# EAGLE design miniFlySong_J010706C (EAGLE 7.7.0)
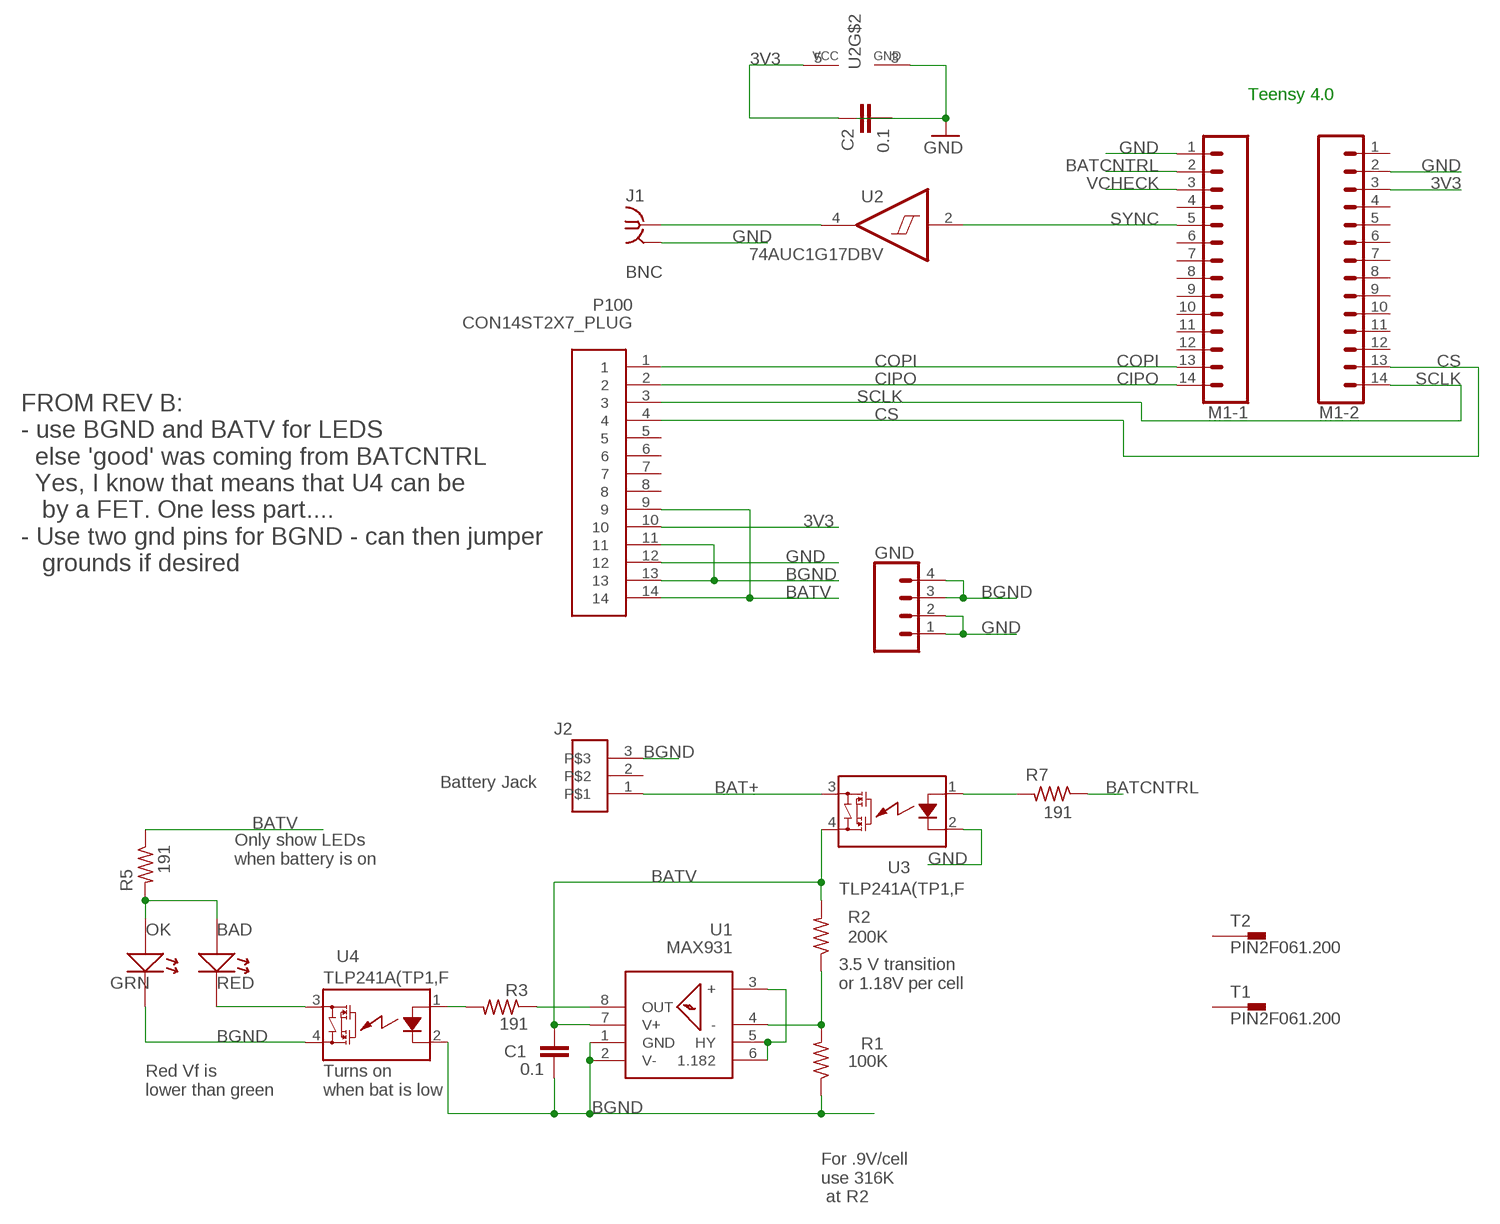
[diagram p0: schematic, sheet 1]

## Parts
BAD  LED4045  [LED_SIDE_SHF4045]
C1  0.1  CAPS0603S  [0603S]
C2  0.1  CAPS0603S  [0603S]
GND  CONN_04LOCK  [1X04_LOCK]
J1  BNC  [BNC-VERT]
J2  Battery Jack  CON3975  [975]
M1-1  CONN_14  [1X14]
M1-2  CONN_14  [1X14]
OK  LED4045  [LED_SIDE_SHF4045]
P100  CON14ST2X7_PLUG  [2X7_PLUG]
R1  100K  RESISTOR_SM0805S  [0805S]
R2  200K  RESISTOR_SM0805S  [0805S]
R3  191  RESISTOR_SM0805S  [0805S]
R5  191  RESISTOR_SM0805S  [0805S]
R7  191  RESISTOR_SM0805S  [0805S]
T1  PIN2F061.200  [F061.200]
T2  PIN2F061.200  [F061.200]
U1  MAX931  [SOIC8]
U2  74AUC1G17DBV  [SOT23-5]
U3  TLP241A(TP1,F  RELAY_SSRSMD4-GULL  [SMD4-GULL]
U4  TLP241A(TP1,F  RELAY_SSRSMD4-GULL  [SMD4-GULL]

## Nets
3V3: C2.1 M1-2.3 P100.10 U2.5(VCC)
BAT+: J2.1 U3.3(DS1)
BATCNTRL: M1-1.2 R7.1
BATV: C1.1 P100.9 P100.14 R2.2 R5.1 U1.7(V+) U3.4(DS2)
BGND: C1.2 GND.3 GND.4 J2.3 OK.C(K) P100.11 P100.13 R1.1 U1.1(GND) U1.2(V-) U4.2(K) U4.4(DS2)
CIPO: M1-1.14 P100.2
COPI: M1-1.13 P100.1
CS: M1-2.13 P100.4
GND: C2.2 GND.1 GND.2 J1.2(GND) M1-1.1 M1-2.2 P100.12 U2.3(GND) U3.2(K)
N$2: J1.1 U2.4(O)
N$3: BAD.A OK.A R5.2
N$4: BAD.C(K) U4.3(DS1)
N$5: R3.2 U4.1(A)
N$7: R7.2 U3.1(A)
N$15: R3.1 U1.8(OUT)
N$18: R1.2 R2.1 U1.4(-)
REF: U1.3(+) U1.5(HY) U1.6(1.182)
SCLK: M1-2.14 P100.3
SYNC: M1-1.5 U2.2(I)
VCHECK: M1-1.3
Unconnected: J2.2 M1-1.4 M1-1.6 M1-1.7 M1-1.8 M1-1.9 M1-1.10 M1-1.11 M1-1.12 M1-2.1 M1-2.4 M1-2.5 M1-2.6 M1-2.7 M1-2.8 M1-2.9 M1-2.10 M1-2.11 M1-2.12 P100.5 P100.6 P100.7 P100.8 T1.1A T1.1B T2.1A T2.1B

## Notes on the sheet
- Teensy 4.0
- FROM REV B:
  - use BGND and BATV for LEDS 
    else 'good' was coming from BATCNTRL
    Yes, I know that means that U4 can be 
     by a FET. One less part....
  - Use two gnd pins for BGND - can then jumper 
     grounds if desired
- Only show LEDs
  when battery is on
- GRN | RED
- 3.5 V transition
  or 1.18V per cell
- Red Vf is 
  lower than green
- Turns on 
  when bat is low
- For .9V/cell
  use 316K
   at R2

## Library data of the parts
BAD OK = STEVES_BU:LED
C1 C2 = STEVES_BU:CAPS
GND = SparkFun-Connectors:CONN_04: Multi connection point. Often used as Generic Header-pin footprint for 0.1 inch spaced/style header connections On any of the 0.1 inch spaced packages, you can populate with these: Break Away Headers - Straight <https://www.sparkfun.com/products/116> (PRT-00116) Break Away Male Headers - Right Angle <https://www.sparkfun.com/products/553> (PRT-00553) Female Headers <https://www.sparkfun.com/products/115> (PRT-00115) Break Away Headers - Machine Pin <https://www.sparkfun.com/products/117> (PRT-00117) Break Away Female Headers - Swiss Machine Pin <https://www.sparkfun.com/products/743> (PRT-00743) For SCREWTERMINALS and SPRING TERMINALS visit here: Screw Terimnals on SparkFun.com <https://www.sparkfun.com/search/results?term=Screw+Terminals> (5mm/3.5mm/2.54mm spacing) This device is also useful as a general connection point to wire up your design to another part of your project. Our various solder wires solder well into these plated through hole pads. Hook-Up Wire - Assortment (Stranded, 22 AWG) <https://www.sparkfun.com/products/11375> (PRT-11375) Hook-Up Wire - Assortment (Solid Core, 22 AWG) <https://www.sparkfun.com/products/11367> (PRT-11367) View the entire wire category on our website here <https://www.sparkfun.com/categories/141> Special notes: Molex polarized connector foot print use with SKU : PRT-08231 with associated crimp pins and housings. 1MM SMD Version SKU: PRT-10208; PROD_ID: CONN-09696
J1 = STEVES_BU:BNC
J2 = STEVES_BU:CON3
M1-1 M1-2 = SparkFun-Connectors:CONN_14: Multi connection point. Often used as Generic Header-pin footprint for 0.1 inch spaced/style header connections On any of the 0.1 inch spaced packages, you can populate with these: Break Away Headers - Straight <https://www.sparkfun.com/products/116> (PRT-00116) Break Away Male Headers - Right Angle <https://www.sparkfun.com/products/553> (PRT-00553) Female Headers <https://www.sparkfun.com/products/115> (PRT-00115) Break Away Headers - Machine Pin <https://www.sparkfun.com/products/117> (PRT-00117) Break Away Female Headers - Swiss Machine Pin <https://www.sparkfun.com/products/743> (PRT-00743) For SCREWTERMINALS and SPRING TERMINALS visit here: Screw Terimnals on SparkFun.com <https://www.sparkfun.com/search/results?term=Screw+Terminals> (5mm/3.5mm/2.54mm spacing) This device is also useful as a general connection point to wire up your design to another part of your project. Our various solder wires solder well into these plated through hole pads. Hook-Up Wire - Assortment (Stranded, 22 AWG) <https://www.sparkfun.com/products/11375> (PRT-11375) Hook-Up Wire - Assortment (Solid Core, 22 AWG) <https://www.sparkfun.com/products/11367> (PRT-11367) View the entire wire category on our website here <https://www.sparkfun.com/categories/141> Special notes: Molex polarized connector foot print use with SKU : PRT-08231 with associated crimp pins and housings. 1MM SMD Version SKU: PRT-10208 NOTES ON THE VARIANTS LOCK and LOCK_LONGPADS... This footprint was designed to help hold the alignment of a through-hole component (i.e. 6-pin header) while soldering it into place. You may notice that each hole has been shifted either up or down by 0.005 of an inch from it's more standard position (which is a perfectly straight line). This slight alteration caused the pins (the squares in the middle) to touch the edges of the holes. Because they are alternating, it causes a "brace" to hold the component in place. 0.005 has proven to be the perfect amount of "off-center" position when using our standard breakaway headers. Although looks a little odd when you look at the bare footprint, once you have a header in there, the alteration is very hard to notice. Also,if you push a header all the way into place, it is covered up entirely on the bottom side.
P100 = STEVES_BU:CON14ST
R1-R3 R5 R7 = STEVES_BU:RESISTOR_SM
T1 T2 = con-faston:PIN2: Flachstecker Typ Tyco/Electronics/AMP TAB, FASTON Printed Circuit Board Tabs Source: http://www.buerklin.com, http://catalog.tycoelectronics.com; OC_FARNELL: unknown; OC_NEWARK: unknown
U1 = STEVES_BU:MAX931
U2 = 74xx-little-us:74*1G17: Single Schmitt-Trigger Buffer
U3 U4 = STEVES_BU:RELAY_SSR

## Board
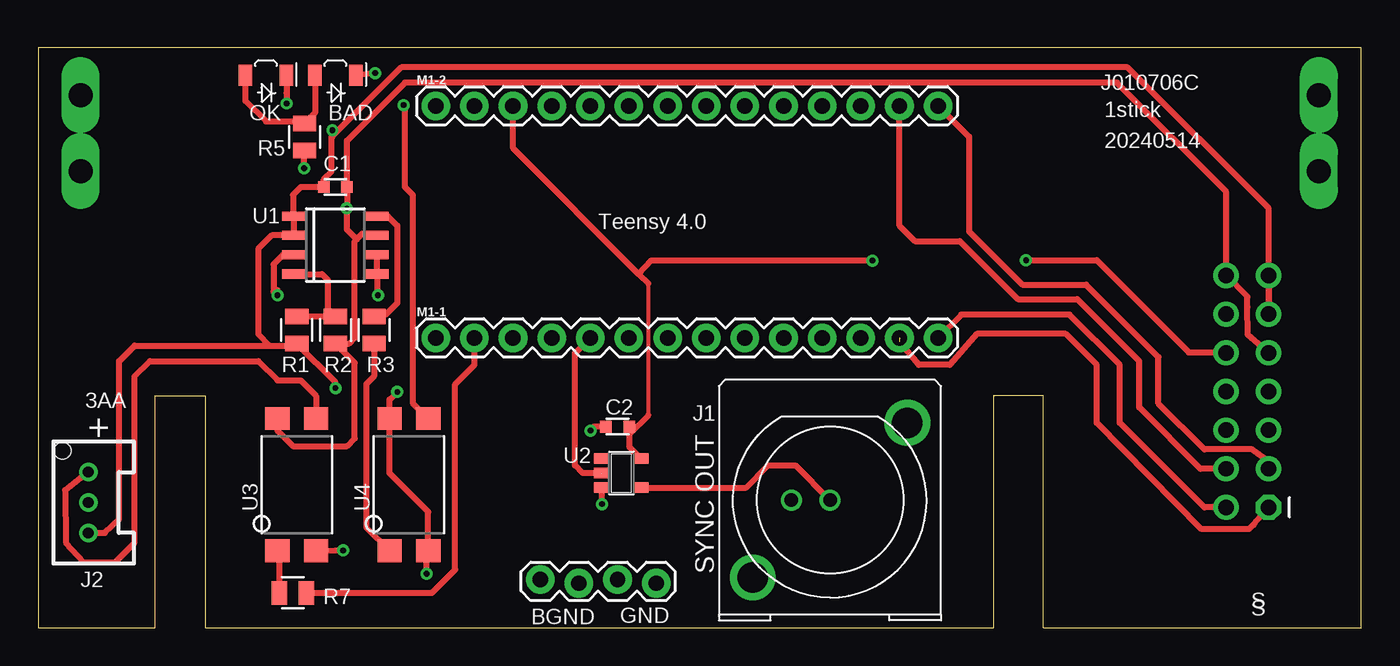
[diagram p1: board, top side]
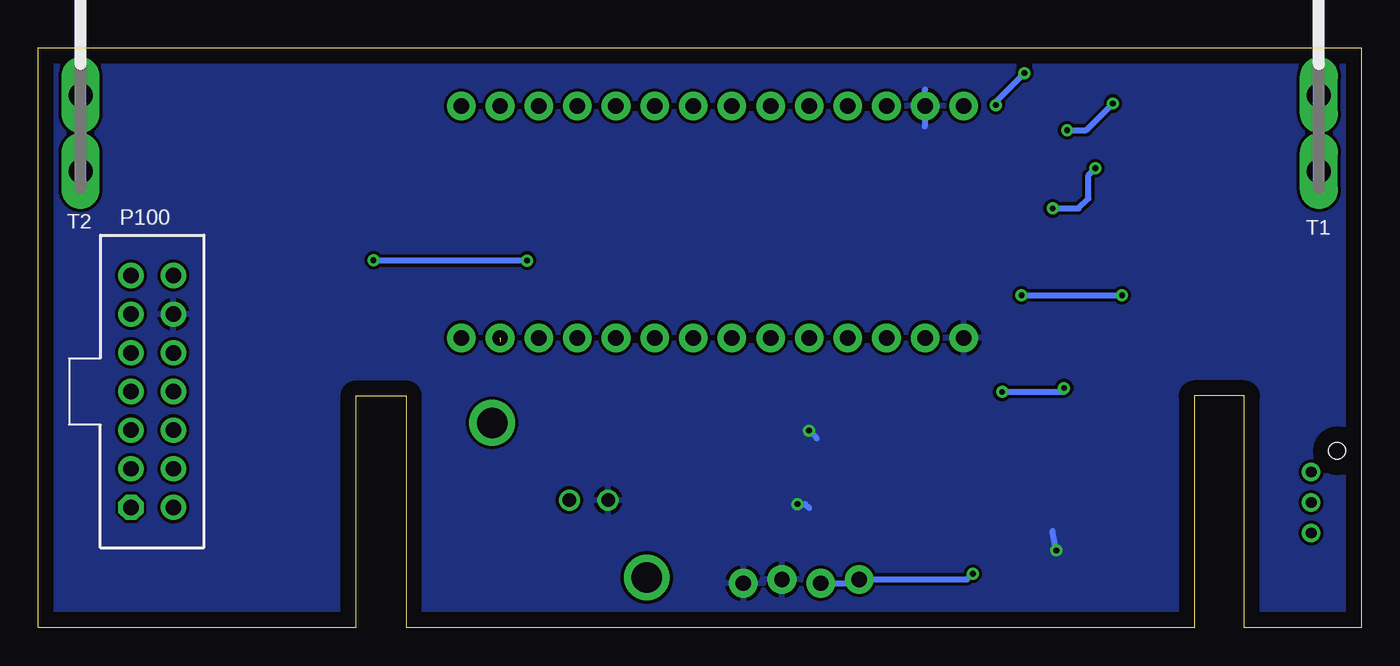
[diagram p2: board, bottom side, seen from below]

Size 87 x 38.1 mm. Coordinates in mm from the lower left corner, seen from the top.
Outline: 0,0 7.7,0 7.7,15.24 11,15.24 11,0 62.8,0 62.8,15.24 66.1,15.24 66.1,0 87,0 87,38.1 0,38.1 0,0
Copper layers (1*16): Top 0.035mm / dielectric 1.5mm / Bottom 0.035mm
Design rules "default *": minimum track width 10mil, minimum drill 12mil, track to track 8mil, track to pad 8mil, pad to pad 8mil, via to via 8mil, smd to smd 8mil, copper to edge 40mil, drill to drill 8mil, minimum pad ring 10mil, minimum via ring 8mil, stop-mask expansion 4mil, vias tented up to drill 0mil, thermal gap 10mil

### Footprints (pad centres in the part's own frame; a part is rotated, then mirrored left to right if it is on the bottom)
LED_SIDE_SHF4045 = smd 0.9 x 1.4: A -1.35,0; C 1.35,0
0603S = smd 0.762 x 0.762: 1 -0.762,0; 2 0.762,0
1X04_LOCK = drill 1.016 pad 1.88: 1 0,0.127; 2 2.54,-0.127; 3 5.08,0.127; 4 7.62,-0.127
BNC-VERT = drill 0.89: 1 0,0; 2 -2.54,0 | drill 2.01: A 5.08,5.08; B -5.08,-5.08
975 = drill 0.71: 1 2,0; 2 0,0; 3 -2,0 | hole 1.1: 3.4,1.7
1X14 = drill 1.016 pad 1.88: 1 0,0; 2 2.54,0; 3 5.08,0; 4 7.62,0; 5 10.16,0; 6 12.7,0; 7 15.24,0; 8 17.78,0; 9 20.32,0; 10 22.86,0; 11 25.4,0; 12 27.94,0; 13 30.48,0; 14 33.02,0
2X7_PLUG = drill 1.016 pad 1.651 octagon: 1 -1.397,-7.62 | drill 1.016 pad 1.651: 2 1.397,-7.62; 3 -1.397,-5.08; 4 1.397,-5.08; 5 -1.397,-2.54; 6 1.397,-2.54; 7 -1.397,0; 8 1.397,0; 9 -1.397,2.54; 10 1.397,2.54; 11 -1.397,5.08; 12 1.397,5.08; 13 -1.397,7.62; 14 1.397,7.62
0805S = smd 1.016 x 1.524: 1 -0.889,0; 2 0.889,0
F061.200 = drill 1.575 pad 2.5 long: 1A -2.5,0; 1B 2.5,0
SOIC8 = smd 0.6 x 1.5: 1 -1.905,-2.75; 2 -0.635,-2.75; 3 0.635,-2.75; 4 1.905,-2.75; 5 1.905,2.75; 6 0.635,2.75; 7 -0.635,2.75; 8 -1.905,2.75
SOT23-5 = smd 0.69 x 0.99: 1 -0.95,-1.29; 2 0,-1.29; 3 0.95,-1.29; 4 0.95,1.3; 5 -0.95,1.3
SMD4-GULL = smd 1.6 x 1.5: 1 -1.27,-4.35; 2 1.27,-4.35; 3 1.27,4.35; 4 -1.27,4.35

### Placement (x,y rotation side)
BAD  19.55,36.3 0 top
C1  19.55,28.96 180 top
C2  38.09,13.21 180 top
GND  40.63,3.05 180 top
J1  52.06,8.38 0 top
J2  3.31,8.23 90 top
M1-1  26.15,19.05 0 top
M1-2  26.15,34.29 0 top
OK  14.98,36.3 0 top
P100  79.5,15.53 0 bottom
R1  17.01,19.56 90 top
R2  19.55,19.56 270 top
R3  22.09,19.56 270 top
R5  17.52,32.26 90 top
R7  16.76,2.29 180 top
T1  2.8,32.5 90 bottom
T2  84.2,32.5 90 bottom
U1  19.55,25.15 270 top
U2  38.35,10.16 270 top
U3  17.01,9.4 0 top
U4  24.38,9.4 0 top

### Tracks (layer width: path | path; a pad name or v marks a point on that pad's centre or on a via)
3V3  (via drill 0.38)
  Top 0.254: 40.12,13.97 40.12,22.61
  Top 0.406: C2.1 38.86,12.7 | 38.86,12.7 38.86,11.9 U2.5 | 39.49,23.24 31.24,31.5 M1-2.3 | 39.49,23.24 40.12,22.61 | 40.12,13.97 38.86,12.7 | v54.86,24.13 40.3,24.13 39.49,23.24 | v64.95,24.15 69.6,24.15 75.65,18.1 78.06,18.1 P100.10
  Bottom 0.406: v54.86,24.13 64.93,24.13 v64.95,24.15
BAT+
  Top 0.406: J2.1 3.27,10.23 1.78,9.04 1.83,5.58 3,4.32 5.07,4.32 6.34,5.59 6.34,16.51 7.36,17.53 14.47,17.53 15.74,16.26 17.27,16.26 18.28,15.24 U3.3
BATCNTRL
  Top 0.406: R7.1 25.9,2.29 27.43,3.81 27.43,16 28.7,17.27 M1-1.2
BATV  (via drill 0.38)
  Top 0.406: U3.4 15.74,12.95 16.76,11.94 20.31,11.94 20.82,12.45 20.82,17.4 R2.2 20.44,18.67 20.82,19.05 20.82,25.4 20.95,25.53 | 20.95,25.53 21.33,25.91 22.18,25.91 U1.7 | 20.31,27.54 C1.1 20.31,32 24.12,35.81 70.92,35.81 78.1,28.64 P100.14 79.5,21.75 79.5,21.08 79.51,19.27 P100.9 | 20.95,25.53 20.31,26.16 20.31,27.54 | 20.31,27.54 v20.3,27.55 | v17.5,30.2 17.5,31.35 R5.1
  Bottom 0.406: v20.3,27.55 18.6,27.55 17.95,28.2 17.95,29.75 v17.5,30.2
BGND  (via drill 0.38)
  Top 0.406: U4.2 25.65,7.62 23.11,10.16 U4.4 23.11,14.99 v23.62,15.49 | v19.55,15.75 19.55,16.13 R1.1 16.88,18.54 15.23,18.54 | P100.13 P100.11 80.89,27.56 71.62,36.83 23.87,36.83 19.3,32.26 | 25.9,4.79 U4.2 | J2.3 4.39,6.23 5.33,7.11 5.33,17.53 6.34,18.54 15.23,18.54 | 15.23,18.54 14.47,19.3 14.47,24.89 15.36,25.78 U1.2 U1.1 16.76,27.09 16.76,28.45 17.27,28.96 C1.2 18.79,29.46 19.3,29.97 19.3,32.26 | OK.C 16.33,35.13 v16.35,34.45 | 19.3,32.26 19.35,32.26 v19.35,32.7 | v25.55,3.55 25.55,4.95 U4.2
  Bottom 0.406: v23.62,15.49 19.55,15.49 v19.55,15.75 | v19.35,32.7 18.09,32.7 v16.35,34.45 | GND.3 33.27,2.92 GND.4 25.93,3.17 v25.55,3.55
CIPO
  Top 0.406: P100.2 76.67,7.91 71.11,13.46 71.11,17.27 67.81,20.57 60.69,20.57 M1-1.14
COPI  (1 unrouted)
  Top 0.406: P100.1 79.89,6.76 79.6,6.47 76.48,6.47 69.59,13.46 69.59,17.27 67.56,19.3 61.72,19.3 59.94,17.27 57.91,17.27 56.64,18.8
CS
  Top 0.406: P100.4 76.42,10.45 72.38,14.48 72.38,17.53 68.31,21.6 64.4,21.6 60.6,25.4 57.65,25.4 56.64,26.42 M1-2.13
GND  (via drill 0.38)
  Top 0.406: U3.2 19.55,5.08 v20.06,5.08 | U2.3 37.06,8.15 v37.08,8.13 | C2.2 36.57,13.21 v36.32,12.95
  Bottom 0.406: v20.06,5.08 20.31,6.35 | v37.08,8.13 36.57,8.13 36.32,7.87 | v36.32,12.95 35.81,12.45 | 28.71,32.94 28.71,34.3 M1-2.2 28.69,35.38
  pour Bottom: 0.12,38.61 87.88,38.61 88.13,-2.29 41.4,-2.29 29.97,-2.03 0.12,-2.29
N$2
  Top 0.406: U2.4 46.54,9.21 48,10.67 49.78,10.67 J1.1
N$3
  Top 0.406: OK.A 13.63,34.62 14.98,33.27 17.39,33.27 R5.2 18.2,33.83 BAD.A
N$4  (via drill 0.38)
  Top 0.406: U4.3 24.63,14.76 24.63,28.45 24.12,28.96 24.12,34.26 v24.03,34.35 | BAD.C 20.9,36.39 v22.17,36.45
  Bottom 0.406: v22.17,36.45 24.07,34.52 v24.03,34.35
N$5
  Top 0.406: R3.2 22.09,16.51 21.58,16 21.58,6.57 U4.1
N$7
  Top 0.406: R7.2 15.87,4.92 U3.1
N$15
  Top 0.406: U1.8 22.98,27.05 23.62,26.42 23.62,21.34 22.85,20.57 22.22,20.57 R3.1
N$18
  Top 0.406: R1.2 R2.1 19.04,20.95 19.04,22.86 18.66,23.24 U1.4
REF  (via drill 0.38)
  Top 0.406: U1.6 U1.5 22.3,21.89 v22.35,21.84 | 15.74,22.18 v15.74,21.84 15.49,22.1 15.49,23.88 16.12,24.51 U1.3
  Bottom 0.406: v22.35,21.84 v15.74,21.84
SCLK
  Top 0.406: P100.3 80.87,10.95 79.8,11.72 76.67,11.72 73.65,14.73 73.65,17.78 68.88,22.55 64.7,22.55 61.21,26.04 61.21,32.27 M1-2.14
SYNC
  Top 0.406: U2.2 35.81,10.16 35.3,10.67 35.3,18.04 M1-1.5

### Text on the board
tPlace: Teensy 4.0 | 3AA | + | SYNC OUT | BGND
tNames: J010706C | 1stick | 20240514 | S | S